# Altium schematic sheet CURRENT_SENSEBOARD.SchDoc
size A
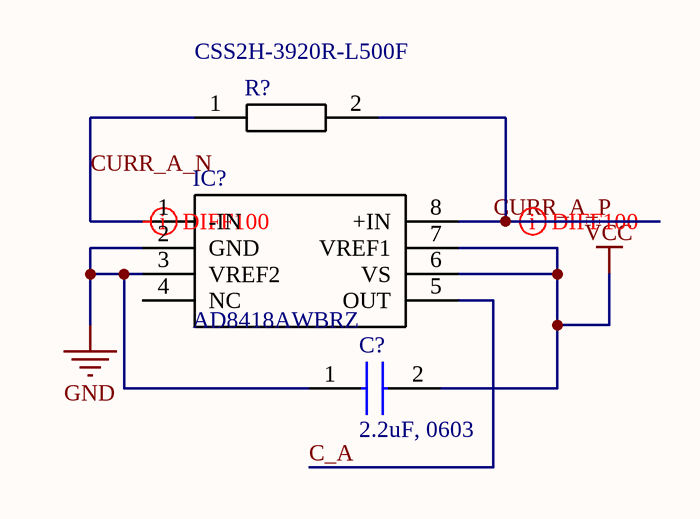
[diagram p0: CURRENT_SENSEBOARD.SchDoc]

## Parts
C?  2.2uF, 0603  [CAPC1005X56N]
IC?  AD8418AWBRZ  [SOP65P490X110-8N]
R?  CSS2H-3920R-L500F  [RESC10052X137N]

## Nets
GND: C?.1 IC?.2(GND) IC?.3(VREF2)
VCC: C?.2 IC?.6(VS) IC?.7(VREF1)
C_A: IC?.5(OUT)
CURR_A_N: IC?.1(-IN) R?.1
CURR_A_P: IC?.8(+IN) R?.2

Not connected (* = marked no-connect by the designer): IC? 4(NC)

## Layout directives
differential pair; differential pair class *; rule Differential Pairs Routing [Pref Gap = 0.254mm    Min Gap  = 0.254mm    Max Gap  = 0.254mmPref Width = 0.381mm    Min Width  = 0.381mm    Max Width  = 0.381mm]: CURR_A_N, CURR_A_P

## Library data of the parts
C? = Ceramic cap 0603: Capacitor; Manufacturer_Name: AVX; Manufacturer_Part_Number: 04024D225KAT2A; Datasheet Link: http://www.mouser.com/catalog/supplier/library/pdf/AVXSurfaceMountCeramic.pdf; Height: 0.56mm; Mouser Part Number: 581-04024D225KAT2A; Mouser Price/Stock: https://www.mouser.com/Search/Refine.aspx?Keyword=581-04024D225KAT2A
IC? = AD8418AWBRZ: Integrated Circuit; Manufacturer_Name: Analog Devices; Datasheet Link: http://www.analog.com/media/en/technical-documentation/data-sheets/AD8418A.pdf; Height: 1.1mm; Manufacturer_Part_Number: AD8418AWBRZ; Mouser Part Number: 584-AD8418AWBRZ; Mouser Price/Stock: https://www.mouser.com/Search/Refine.aspx?Keyword=584-AD8418AWBRZ; RS Part Number: 7989903; RS Price/Stock: https://uk.rs-online.com/web/p/products/7989903
R? = CSS2H-3920R-L500F: Resistor; Manufacturer_Name: Bourns; Allied_Number: 70883778; Datasheet Link: https://componentsearchengine.com/Datasheets/2/CSS2H-3920R-L500F.pdf; Height: 1.37mm; Manufacturer_Part_Number: CSS2H-3920R-L500F; Mouser Part Number: 652-CSS2H3920RL500F; Mouser Price/Stock: https://www.mouser.com/Search/Refine.aspx?Keyword=652-CSS2H3920RL500F; Allied Price/Stock: https://www.alliedelec.com/bourns-css2h-3920r-l500f/70883778/